# EAGLE design ledmatrixdriver (EAGLE 6.0)
8x8 RGB LED Matrix Driver (C) Elco Jacobs www.elcojacobs.com
DRAWING_AUTHOR: Elco Jacobs
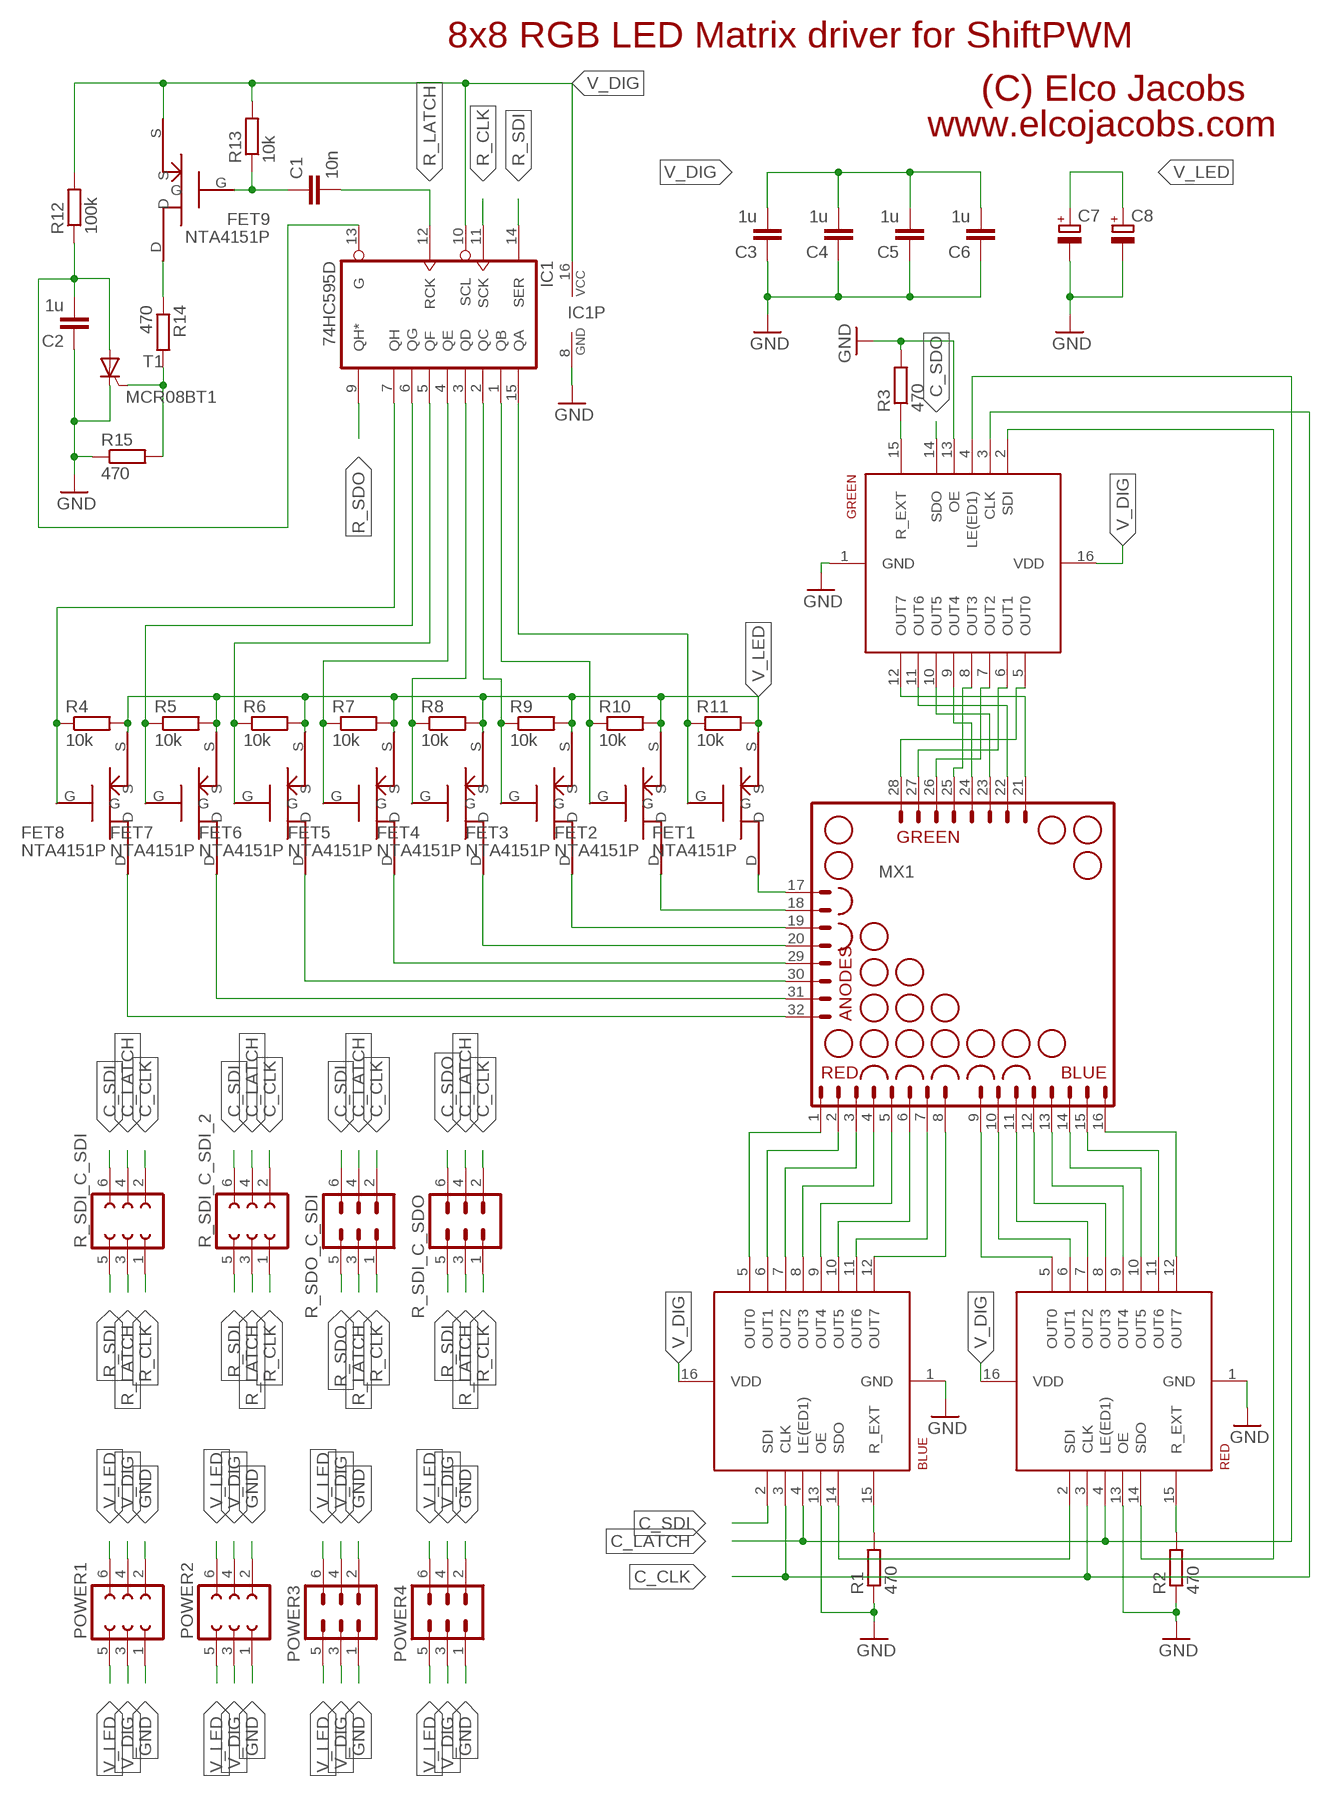
[diagram p0: schematic, sheet 1]

## Parts
BLUE  TLC5916  TLC5916/17  [SOIC-16]
C1  10n  C-EUC0805  [C0805]
C2  1u  C-EUC0805  [C0805]
C3  1u  C-EUC0805  [C0805]
C4  1u  C-EUC0805  [C0805]
C5  1u  C-EUC0805  [C0805]
C6  1u  C-EUC0805  [C0805]
C7  CPOL-EU153CLV-0505  [153CLV-0505]
C8  CPOL-EU153CLV-0505  [153CLV-0505]
FET1  NTA4151P  [NTA4151P]
FET2  NTA4151P  [NTA4151P]
FET3  NTA4151P  [NTA4151P]
FET4  NTA4151P  [NTA4151P]
FET5  NTA4151P  [NTA4151P]
FET6  NTA4151P  [NTA4151P]
FET7  NTA4151P  [NTA4151P]
FET8  NTA4151P  [NTA4151P]
FET9  NTA4151P  [NTA4151P]
GREEN  TLC5916  TLC5916/17  [SOIC-16]
IC1  74HC595D  [SO16]
MX1  MATRIX_8X8_TRICOLOR_ANODE_ROW  [MATRIX_60MM_32PIN]
POWER1  FE03-2W  [FE03-2W]
POWER2  FE03-2W  [FE03-2W]
POWER3  MA03-2W  [MA03-2W]
POWER4  MA03-2W  [MA03-2W]
R1  470  R-EU_R0805  [R0805]
R2  470  R-EU_R0805  [R0805]
R3  470  R-EU_R0805  [R0805]
R4  10k  R-EU_R0402  [R0402]
R5  10k  R-EU_R0402  [R0402]
R6  10k  R-EU_R0402  [R0402]
R7  10k  R-EU_R0402  [R0402]
R8  10k  R-EU_R0402  [R0402]
R9  10k  R-EU_R0402  [R0402]
R10  10k  R-EU_R0402  [R0402]
R11  10k  R-EU_R0402  [R0402]
R12  100k  R-EU_R0805  [R0805]
R13  10k  R-EU_R0402  [R0402]
R14  470  R-EU_R0805  [R0805]
R15  470  R-EU_R0805  [R0805]
R_SDI_C_SDI  FE03-2W  [FE03-2W]
R_SDI_C_SDI_2  FE03-2W  [FE03-2W]
R_SDI_C_SDO  MA03-2W  [MA03-2W]
R_SDO_C_SDI  MA03-2W  [MA03-2W]
RED  TLC5916  TLC5916/17  [SOIC-16]
T1  MCR08BT1  [SOT223]

## Nets
C_CLK: BLUE.3(CLK) GREEN.3(CLK) R_SDI_C_SDI.2 R_SDI_C_SDI_2.2 R_SDI_C_SDO.2 R_SDO_C_SDI.2 RED.3(CLK)
C_LATCH: BLUE.4(LE(ED1)) GREEN.4(LE(ED1)) R_SDI_C_SDI.4 R_SDI_C_SDI_2.4 R_SDI_C_SDO.4 R_SDO_C_SDI.4 RED.4(LE(ED1))
C_SDI: BLUE.2(SDI) R_SDI_C_SDI.6 R_SDI_C_SDI_2.6 R_SDO_C_SDI.6
C_SDO: GREEN.14(SDO) R_SDI_C_SDO.6
GND: BLUE.1(GND) BLUE.13(OE) C2.1 C3.1 C4.1 C5.1 C6.1 C7.- C8.- GREEN.1(GND) GREEN.13(OE) IC1.8(GND) POWER1.1 POWER1.2 POWER2.1 POWER2.2 POWER3.1 POWER3.2 POWER4.1 POWER4.2 R1.1 R2.1 R3.2 R15.1 RED.1(GND) RED.13(OE) T1.K(C)
N$1: BLUE.5(OUT0) MX1.1
N$2: BLUE.6(OUT1) MX1.2
N$3: BLUE.7(OUT2) MX1.3
N$4: BLUE.8(OUT3) MX1.4
N$5: BLUE.9(OUT4) MX1.5
N$6: BLUE.10(OUT5) MX1.6
N$7: BLUE.11(OUT6) MX1.7
N$8: BLUE.12(OUT7) MX1.8
N$10: MX1.10 RED.6(OUT1)
N$11: MX1.11 RED.7(OUT2)
N$12: MX1.12 RED.8(OUT3)
N$13: MX1.13 RED.9(OUT4)
N$14: MX1.14 RED.10(OUT5)
N$15: MX1.15 RED.11(OUT6)
N$16: MX1.16 RED.12(OUT7)
N$17: GREEN.12(OUT7) MX1.21
N$18: GREEN.11(OUT6) MX1.22
N$19: GREEN.10(OUT5) MX1.23
N$20: GREEN.9(OUT4) MX1.24
N$21: GREEN.8(OUT3) MX1.25
N$22: GREEN.7(OUT2) MX1.26
N$23: GREEN.6(OUT1) MX1.27
N$24: GREEN.5(OUT0) MX1.28
N$25: FET1.D MX1.17
N$26: FET2.D MX1.18
N$27: FET3.D MX1.19
N$28: FET4.D MX1.20
N$29: FET5.D MX1.29
N$30: FET6.D MX1.30
N$31: FET7.D MX1.31
N$32: FET8.D MX1.32
N$34: FET1.G IC1.15(QA) R11.1
N$35: FET2.G IC1.1(QB) R10.1
N$36: FET3.G IC1.2(QC) R9.1
N$37: FET4.G IC1.3(QD) R8.1
N$38: FET5.G IC1.4(QE) R7.1
N$39: FET6.G IC1.5(QF) R6.1
N$40: FET7.G IC1.6(QG) R5.1
N$41: C2.2 IC1.13(G) R12.1 T1.A T1.A2(A)
N$42: BLUE.15(R_EXT) R1.2
N$43: R2.2 RED.15(R_EXT)
N$44: GREEN.15(R_EXT) R3.1
N$45: BLUE.14(SDO) RED.2(SDI)
N$46: FET9.D R14.1
N$47: R14.2 R15.2 T1.G
N$48: GREEN.2(SDI) RED.14(SDO)
N$49: C1.1 FET9.G R13.1
OUT0B: MX1.9 RED.5(OUT0)
QH: FET8.G IC1.7(QH) R4.1
R_CLK: IC1.11(SCK) R_SDI_C_SDI.1 R_SDI_C_SDI_2.1 R_SDI_C_SDO.1 R_SDO_C_SDI.1
R_LATCH: C1.2 IC1.12(RCK) R_SDI_C_SDI.3 R_SDI_C_SDI_2.3 R_SDI_C_SDO.3 R_SDO_C_SDI.3
R_SDI: IC1.14(SER) R_SDI_C_SDI.5 R_SDI_C_SDI_2.5 R_SDI_C_SDO.5
R_SDO: IC1.9(QH*) R_SDO_C_SDI.5
V_DIG: BLUE.16(VDD) C3.2 C4.2 C5.2 C6.2 FET9.S GREEN.16(VDD) IC1.10(SCL) IC1.16(VCC) POWER1.3 POWER1.4 POWER2.3 POWER2.4 POWER3.3 POWER3.4 POWER4.3 POWER4.4 R12.2 R13.2 RED.16(VDD)
V_LED: C7.+ C8.+ FET1.S FET2.S FET3.S FET4.S FET5.S FET6.S FET7.S FET8.S POWER1.5 POWER1.6 POWER2.5 POWER2.6 POWER3.5 POWER3.6 POWER4.5 POWER4.6 R4.2 R5.2 R6.2 R7.2 R8.2 R9.2 R10.2 R11.2

## Notes on the sheet
- 8x8 RGB LED Matrix driver for ShiftPWM
- (C) Elco Jacobs
- www.elcojacobs.com

## Library data of the parts
BLUE GREEN RED = BillPorter:TLC5916/17: TLC5916/17 8-Channel Constant-Current LED Sink Driver and Shift Register in one. Great for driving high current LEDs that would kill a 595 shift register. Specs @ http://focus.ti.com/docs/prod/folders/print/tlc5916.html
C1-C6 = rcl:C-EU: CAPACITOR, European symbol
C7 C8 = rcl:CPOL-EU: POLARIZED CAPACITOR, European symbol
FET1-FET9 = NTA4151P:NTA4151P
IC1 = 74xx-eu:74*595: 8-bit SHIFT REGISTER, output latch
MX1 = matrix:MATRIX_8X8_TRICOLOR_ANODE_ROW: RGB 8x8 LED Matrix This variety of display has one anode pin for each row, and three cathode pins for each column. Each anode is shared by red, green and blue cathodes for each cell in the matrix. This part matches the matrix sold by LEDsee.com (SKU: RGBMATRIX) and Seeedstudio.com (SKU: LEDRGBMatrix). The datasheet lists the source as "Guoyexing Optoelectronics Co. Ltd.," part number GYXM-2388AURPGB.
POWER1 POWER2 R_SDI_C_SDI R_SDI_C_SDI_2 = con-lsta:FE03-2W: FEMALE HEADER
POWER3 POWER4 R_SDI_C_SDO R_SDO_C_SDI = con-lstb:MA03-2: PIN HEADER
R1-R15 = resistor:R-EU_: RESISTOR, European symbol
T1 = MCR08BT1:MCR08BT1

## Board
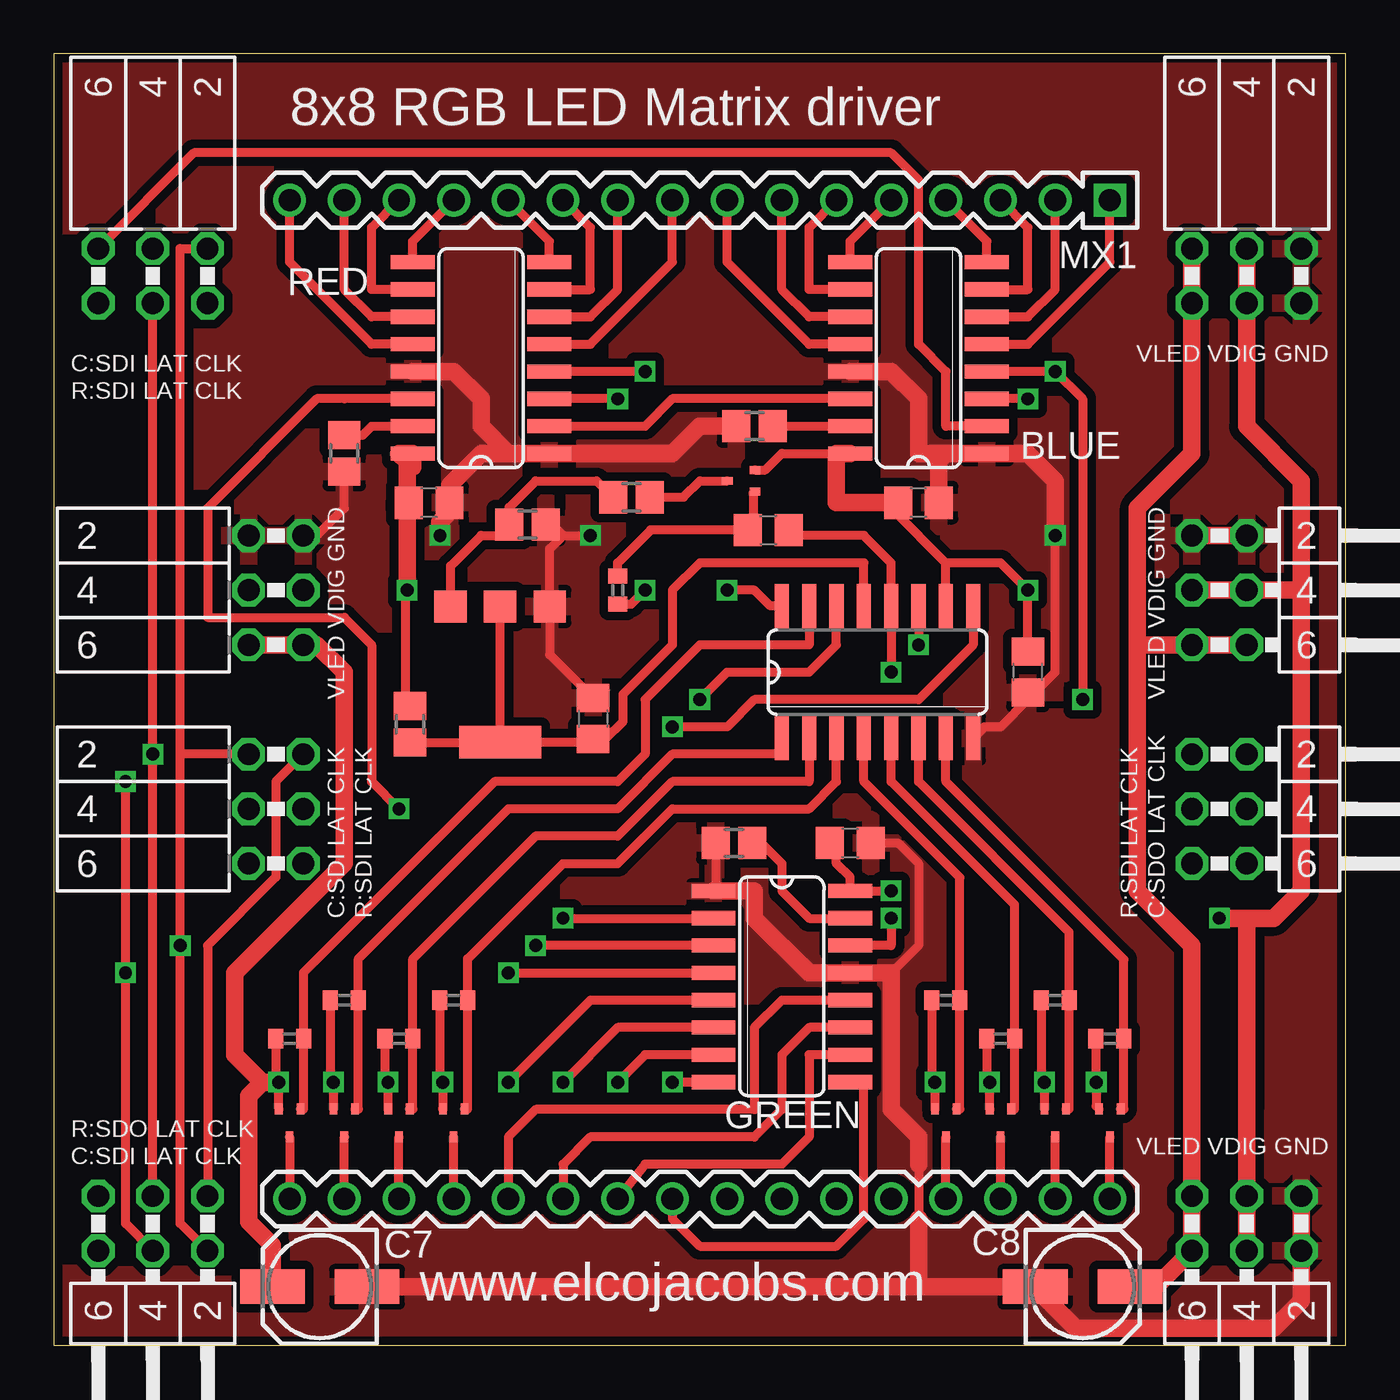
[diagram p1: board, top side]
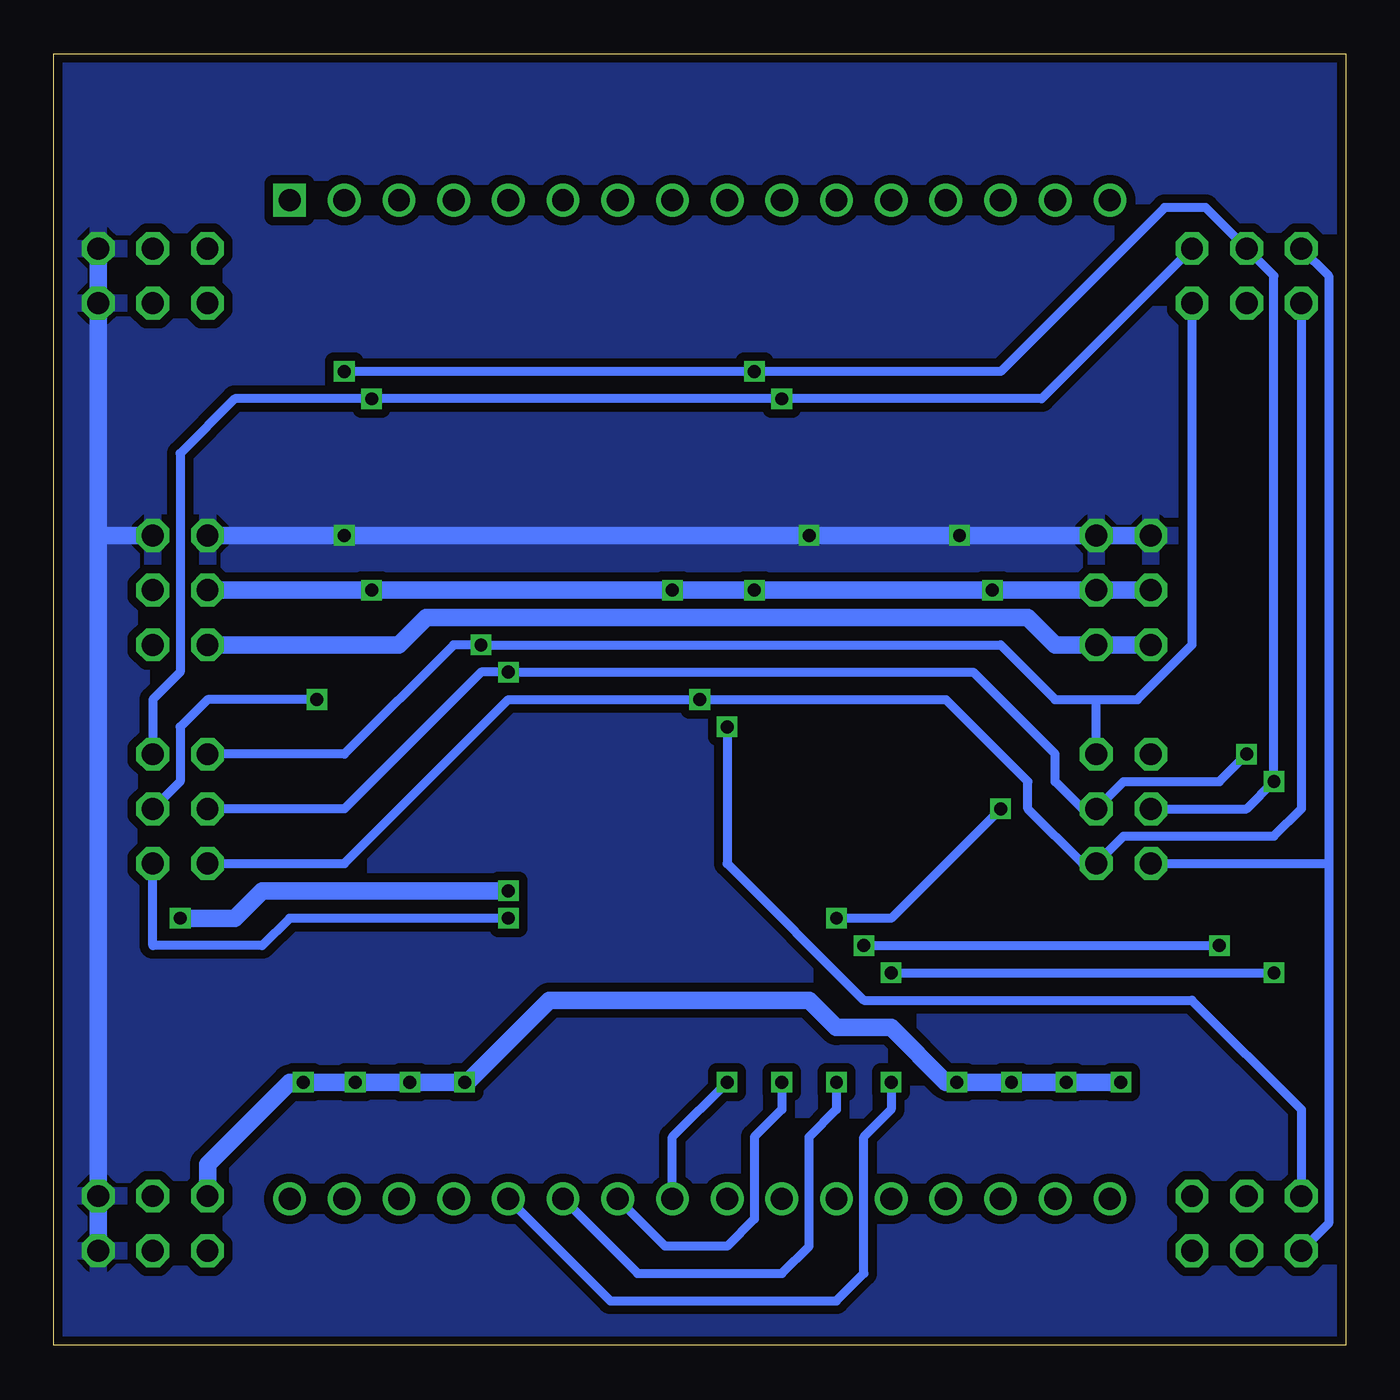
[diagram p2: board, bottom side, seen from below]

Size 60 x 60 mm. Coordinates in mm from the lower left corner, seen from the top.
Outline: 0,0 60,0 60,60 0,60 0,0
Copper layers (1*16): Top 0.0356mm / dielectric 1.5011mm / Bottom 0.0356mm
Design rules: minimum track width 6mil, minimum drill 13mil, track to track 6mil, track to pad 6mil, pad to pad 6mil, via to via 6mil, smd to smd 6mil, copper to edge 15mil, drill to drill 6mil, minimum pad ring 7mil, minimum via ring 7mil, stop-mask expansion 4mil, vias tented up to drill 0mil, thermal gap 10mil

### Footprints (pad centres in the part's own frame; a part is rotated, then mirrored left to right if it is on the bottom)
SOIC-16 = smd 0.66 x 2.032: 1 -3.81,-3.175; 2 -2.54,-3.175; 3 -1.27,-3.175; 4 0,-3.175; 5 1.27,-3.175; 6 2.54,-3.175; 7 3.81,-3.175; 8 5.08,-3.175; 9 5.08,3.175; 10 3.81,3.175; 11 2.54,3.175; 12 1.27,3.175; 13 0,3.175; 14 -1.27,3.175; 15 -2.54,3.175; 16 -3.81,3.175
C0805 = smd 1.3 x 1.5: 1 -0.95,0; 2 0.95,0
153CLV-0505 = smd 3 x 1.6: + 2.2,0; - -2.2,0
NTA4151P = smd 0.356 x 0.508: D 0,0; G -0.5,-1.295; S 0.5,-1.295
SO16 = smd 0.66 x 2.032: 1 -4.445,-3.073; 2 -3.175,-3.073; 3 -1.905,-3.073; 4 -0.635,-3.073; 5 0.635,-3.073; 6 1.905,-3.073; 7 3.175,-3.073; 8 4.445,-3.073; 9 4.445,3.073; 10 3.175,3.073; 11 1.905,3.073; 12 0.635,3.073; 13 -0.635,3.073; 14 -1.905,3.073; 15 -3.175,3.073; 16 -4.445,3.073
MATRIX_60MM_32PIN = drill 1.016 square: 1 -19.05,-23.2 | drill 1.016: 2 -16.51,-23.2; 3 -13.97,-23.2; 4 -11.43,-23.2; 5 -8.89,-23.2; 6 -6.35,-23.2; 7 -3.81,-23.2; 8 -1.27,-23.2; 9 1.27,-23.2; 10 3.81,-23.2; 11 6.35,-23.2; 12 8.89,-23.2; 13 11.43,-23.2; 14 13.97,-23.2; 15 16.51,-23.2; 16 19.05,-23.2; 17 19.05,23.2; 18 16.51,23.2; 19 13.97,23.2; 20 11.43,23.2; 21 8.89,23.2; 22 6.35,23.2; 23 3.81,23.2; 24 1.27,23.2; 25 -1.27,23.2; 26 -3.81,23.2; 27 -6.35,23.2; 28 -8.89,23.2; 29 -11.43,23.2; 30 -13.97,23.2; 31 -16.51,23.2; 32 -19.05,23.2
FE03-2W = drill 1.016 octagon: 1 -5.08,5.08; 2 -5.08,2.54; 3 -2.54,5.08; 4 -2.54,2.54; 5 0,5.08; 6 0,2.54
MA03-2W = drill 1.016 octagon: 1 -5.08,-5.08; 2 -5.08,-2.54; 3 -2.54,-5.08; 4 -2.54,-2.54; 5 0,-5.08; 6 0,-2.54
R0805 = smd 1.3 x 1.5: 1 -0.85,0; 2 0.85,0
R0402 = smd 0.7 x 0.9: 1 -0.65,0; 2 0.65,0
SOT223 = smd 3.8 x 1.5: A 0,6.3 | smd 1.5 x 1.5: A2 0,0; G 2.3,0; K -2.3,0

### Placement (x,y rotation side)
BLUE  40.16,45.24 90 top
C1  33.18,37.87 0 top
C2  25.05,29.11 270 top
C3  17.43,39.14 180 top
C4  40.16,39.14 180 top
C5  45.24,31.27 90 top
C6  36.99,23.33 180 top
C7  12.35,2.72 180 top
C8  47.78,2.72 0 top
FET1  10.95,9.68 180 top
FET2  13.49,9.68 180 top
FET3  16.03,9.68 180 top
FET4  18.57,9.68 180 top
FET5  41.43,9.68 180 top
FET6  43.97,9.68 180 top
FET7  46.51,9.68 180 top
FET8  49.05,9.68 180 top
FET9  31.27,40.16 90 top
GREEN  33.81,17.3 270 top
IC1  38.26,31.27 0 top
MX1  30,30 180 top
POWER1  52.86,53.5 180 top
POWER2  6.51,32.54 270 top
POWER3  52.86,1.85 180 top
POWER4  57.94,32.54 270 top
R1  32.54,42.7 0 top
R2  13.49,41.43 90 top
R3  31.59,23.33 180 top
R4  49.05,14.25 180 top
R5  46.51,16.03 180 top
R6  43.97,14.25 180 top
R7  41.43,16.03 180 top
R8  18.57,16.03 180 top
R9  16.03,14.25 180 top
R10  13.49,16.03 180 top
R11  10.95,14.25 180 top
R12  16.54,28.86 90 top
R13  26.19,35.08 270 top
R14  26.82,39.4 180 top
R15  22,38.13 180 top
R_SDI_C_SDI  2.06,53.5 180 top
R_SDI_C_SDI_2  6.51,22.38 270 top
R_SDI_C_SDO  57.94,22.38 270 top
R_SDO_C_SDI  2.06,1.85 180 top
RED  19.84,45.24 90 top
T1  20.73,34.32 180 top

### Tracks (layer width: path | path; a pad name or v marks a point on that pad's centre or on a via)
C_CLK  (via drill 0.6)
  Top 0.406: v26.19,43.97 RED.3 | v45.24,43.97 BLUE.3 | 5.87,27.46 v5.87,18.57 5.87,5.66 R_SDO_C_SDI.2 | 5.87,27.46 5.87,50.96 R_SDI_C_SDI.2 | R_SDI_C_SDI_2.2 5.87,27.46 | GREEN.3 v22.38,18.57
  Bottom 0.406: R_SDI_C_SDO.2 55.4,30 54.13,31.27 54.13,41.43 51.59,43.97 v45.24,43.97 v26.19,43.97 14.12,43.97 R_SDI_C_SDI.2 | v22.38,18.57 v5.87,18.57
C_LATCH  (via drill 0.6)
  Top 0.406: v27.46,45.24 RED.4 | v21.11,17.3 GREEN.4 | v47.78,30 47.78,43.97 v46.51,45.24 BLUE.4 | v3.33,26.19 v3.33,17.3 3.33,5.66 R_SDO_C_SDI.4
  Bottom 0.406: R_SDI_C_SDI_2.4 4.6,24.92 v3.33,26.19 3.33,49.69 R_SDI_C_SDI.4 6.51,52.86 8.41,52.86 16.03,45.24 v27.46,45.24 v46.51,45.24 | v47.78,30 52.86,30 54.13,28.73 54.13,26.19 R_SDI_C_SDO.4 | v21.11,17.3 v3.33,17.3
C_SDI
  Top 0.406: BLUE.2 41.43,42.7 41.43,45.24 40.16,46.51 40.16,54.13 38.89,55.4 6.51,55.4 R_SDI_C_SDI.6
  Bottom 0.406: 0.79,22.38 0.79,49.69 R_SDI_C_SDI.6 | 0.79,22.38 0.79,5.66 R_SDO_C_SDI.6 | R_SDI_C_SDI_2.6 0.79,22.38
C_SDO  (via drill 0.6)
  Top 0.406: v38.89,19.84 38.89,18.57 GREEN.14
  Bottom 0.406: v38.89,19.84 49.05,19.84 50.32,18.57 55.4,18.57 R_SDI_C_SDO.6
GND  (via drill 0.6)
  Top 0.406: 40.16,8.41 40.16,5.87 | v46.51,37.62 46.51,31.27 45.56,30.32 C5.1 45.24,30 43.97,28.73 43.23,28.73 IC1.8 | 20.92,41.24 21.11,41.43 28.73,41.43 | R15.1 23.14,38.13 23.65,37.62 | 23.65,37.62 v24.92,37.62 | 23.65,37.62 23.03,37 T1.K 23.03,32.08 C2.1 | C3.1 18.38,39.08 18.57,38.89 | POWER2.1 12.22,37.62 13.49,38.89 R2.1 | C6.1 39.21,23.33 40.16,22.38 40.16,18.57 38.89,17.3 | R3.2 30.74,21.21 GREEN.1 | 45.56,2.69 45.56,2.7 C8.-
  Top 0.813: 41.43,41.43 BLUE.1 45.24,41.43 46.51,40.16 v46.51,37.62 | 41.43,41.43 40.16,41.43 40.16,43.97 38.89,45.24 BLUE.13 | 21.11,41.43 RED.1 28.73,41.43 30,42.7 R1.1 | 21.11,41.43 19.84,42.7 19.84,43.97 18.57,45.24 RED.13 | POWER4.2 POWER4.1 | 40.16,8.41 40.16,9.68 38.89,10.95 38.89,17.3 GREEN.13 35.08,17.3 32.54,19.84 32.54,21.11 GREEN.1 | POWER3.1 POWER3.2 57.94,2.06 56.67,0.79 47.46,0.79 45.56,2.69 | C7.- 40.16,2.72 | 40.16,2.72 C8.- | 40.16,5.87 40.16,2.72 | C4.1 41.11,41.11 41.43,41.43 | C3.1 18.38,39.97 19.84,41.43 21.11,41.43 | v17.93,37.62 17.93,38.26 18.57,38.89
  Bottom 0.813: POWER4.1 v46.51,37.62 v24.92,37.62 v17.93,37.62 POWER2.1 POWER2.2 | 57.94,37.62 POWER1.1 POWER1.2 | 57.94,37.62 POWER3.2 | POWER4.2 57.94,37.62
  pour Bottom (isolate 0.406): -0.16,60.16 -0.16,0.16 60.16,0.16 60.16,60.16
  pour Top (isolate 0.406): -0.16,60.16 60.16,60.16 60.16,0.16 -0.16,0.16
N$1
  Top 0.406: BLUE.5 45.24,46.51 49.05,50.32 MX1.1
N$2
  Top 0.406: BLUE.6 45.24,47.78 46.51,49.05 MX1.2
N$3
  Top 0.406: BLUE.7 45.24,49.05 45.24,51.93 MX1.3
N$4
  Top 0.406: BLUE.8 43.34,51.3 MX1.4
N$5
  Top 0.406: BLUE.9 36.99,51.3 MX1.5
N$6
  Top 0.406: BLUE.10 35.08,49.05 35.08,51.93 MX1.6
N$7
  Top 0.406: BLUE.11 35.08,47.78 33.81,49.05 MX1.7
N$8
  Top 0.406: BLUE.12 35.08,46.51 31.27,50.32 MX1.8
N$10
  Top 0.406: RED.6 24.92,47.78 26.19,49.05 MX1.10
N$11
  Top 0.406: RED.7 24.92,49.05 24.92,51.93 MX1.11
N$12
  Top 0.406: RED.8 23.02,51.3 MX1.12
N$13
  Top 0.406: RED.9 16.66,51.3 MX1.13
N$14
  Top 0.406: RED.10 14.76,49.05 14.76,51.93 MX1.14
N$15
  Top 0.406: RED.11 14.76,47.78 13.49,49.05 MX1.15
N$16
  Top 0.406: RED.12 14.76,46.51 10.95,50.32 MX1.16
N$17
  Top 0.406: GREEN.12 33.81,16.03 32.54,14.76 32.54,10.95 22.38,10.95 21.11,9.68 MX1.21
N$18
  Top 0.406: GREEN.11 35.08,14.76 33.81,13.49 33.81,10.95 32.54,9.68 24.92,9.68 23.65,8.41 MX1.22
N$19
  Top 0.406: GREEN.10 35.08,13.49 35.08,9.68 33.81,8.41 27.46,8.41 MX1.23
N$20
  Top 0.406: MX1.24 28.73,5.87 30,4.6 36.35,4.6 37.62,5.87 37.62,12.22 GREEN.9
N$21  (via drill 0.6)
  Top 0.406: GREEN.8 v28.73,12.22
  Bottom 0.406: MX1.25 31.27,9.68 v28.73,12.22
N$22  (via drill 0.6)
  Top 0.406: GREEN.7 27.46,13.49 v26.19,12.22
  Bottom 0.406: v26.19,12.22 26.19,10.95 27.46,9.68 27.46,5.87 28.73,4.6 31.61,4.6 MX1.26
N$23  (via drill 0.6)
  Top 0.406: GREEN.6 26.19,14.76 v23.65,12.22
  Bottom 0.406: v23.65,12.22 23.65,10.95 24.92,9.68 24.92,4.6 26.19,3.33 32.88,3.33 MX1.27
N$24  (via drill 0.6)
  Top 0.406: GREEN.5 24.92,16.03 v21.11,12.22
  Bottom 0.406: v21.11,12.22 21.11,10.95 22.38,9.68 22.38,3.33 23.65,2.06 34.15,2.06 MX1.28
N$25
  Top 0.406: FET1.D MX1.17
N$26
  Top 0.406: MX1.18 FET2.D
N$27
  Top 0.406: MX1.19 FET3.D
N$28
  Top 0.406: MX1.20 FET4.D
N$29
  Top 0.406: MX1.29 FET5.D
N$30
  Top 0.406: MX1.30 FET6.D
N$31
  Top 0.406: MX1.31 FET7.D
N$32
  Top 0.406: MX1.32 FET8.D
N$34
  Top 0.406: FET1.G 11.6,10.97 R11.1 11.6,17.32 20.47,26.19 26.19,26.19 27.46,27.46 27.46,30 30,32.54 35.08,32.54 IC1.15
N$35
  Top 0.406: FET2.G 14.14,10.97 R10.1 14.14,17.95 21.11,24.92 26.19,24.92 28.73,27.46 33.81,27.46 IC1.1
N$36
  Top 0.406: FET3.G 16.68,10.97 R9.1 16.68,17.95 22.38,23.65 26.19,23.65 28.73,26.19 35.08,26.19 IC1.2
N$37
  Top 0.406: FET4.G 19.22,10.97 R8.1 19.22,17.95 23.65,22.38 26.19,22.38 28.73,24.92 35.08,24.92 36.35,26.19 IC1.3
N$38
  Top 0.406: FET5.G 42.08,10.97 R7.1 42.08,21.73 37.62,26.19 IC1.4
N$39
  Top 0.406: FET6.G 44.62,10.97 R6.1 44.62,20.46 38.89,26.19 IC1.5
N$40
  Top 0.406: FET7.G 47.16,10.97 R5.1 47.16,19.19 40.16,26.19 IC1.6
N$41
  Top 0.406: T1.A T1.A2 | R12.1 20.72,28.01 T1.A | T1.A 24.9,28.02 C2.2 25.62,28.16 26.44,28.98 26.44,30.25 28.73,32.54 28.73,35.08 30,36.35 37.62,36.35 IC1.13
N$42
  Top 0.406: R1.2 BLUE.15 37.62,42.7
N$43
  Top 0.406: R2.2 14.34,42.28 14.76,42.7 RED.15
N$44
  Top 0.406: R3.1 32.86,23.33 33.81,22.38 33.81,21.11 35.08,19.84 GREEN.15
N$45
  Top 0.406: RED.2 27.46,42.7 28.73,43.97 BLUE.14
N$46
  Top 0.406: R14.1 29.24,39.4 30,40.16 FET9.D
N$47
  Top 0.406: T1.G 18.43,36.21 19.84,37.62 21.11,37.62 21.11,38.09 R15.2 21.15,38.93 22.38,40.16 25.21,40.16 R14.2
N$48  (via drill 0.6)
  Top 0.406: 13.49,43.97 RED.14 12.22,43.97 7.14,38.89 7.14,33.81 13.49,33.81 14.76,32.54 14.76,26.19 v16.03,24.92 | v23.65,19.84 GREEN.2
  Bottom 0.406: v16.03,24.92 21.11,19.84 v23.65,19.84
N$49
  Top 0.406: FET9.G 32.48,39.57 32.48,37.68 | 32.48,37.68 32.54,37.62 | R13.1 26.19,36.35 27.71,37.87 C1.1 32.29,37.87 32.48,37.68
OUT0B
  Top 0.406: RED.5 24.92,46.51 28.73,50.32 MX1.9
QH
  Top 0.406: FET8.G 49.7,10.97 R4.1 49.7,17.92 41.43,26.19 IC1.7
R_CLK  (via drill 0.6)
  Top 0.406: IC1.11 v40.16,32.54 | R_SDO_C_SDI.1 7.14,18.57 10.31,21.75 10.31,26.19 R_SDI_C_SDI_2.1
  Bottom 0.406: R_SDI_C_SDO.1 46.51,27.46 41.43,32.54 v40.16,32.54 16.03,32.54 13.49,30 11.58,30 | R_SDI_C_SDI.1 7.14,32.54 9.68,30 11.58,30 | R_SDI_C_SDI_2.1 11.58,30
R_LATCH  (via drill 0.6)
  Top 0.406: R_SDO_C_SDI.3 v4.6,27.46 R_SDI_C_SDI.3 | v38.89,31.27 IC1.12 38.89,36.35 37.62,37.62 34.38,37.62 C1.2
  Bottom 0.406: R_SDI_C_SDO.3 46.51,24.92 40.16,31.27 v38.89,31.27 17.3,31.27 13.49,27.46 13.49,26.19 12.22,24.92 R_SDI_C_SDI_2.3 10.31,26.19 5.87,26.19 v4.6,27.46
R_SDI  (via drill 0.6)
  Top 0.406: v30,30 31.27,31.27 35.08,31.27 36.35,32.54 IC1.14
  Bottom 0.406: R_SDI_C_SDI.5 2.06,24.92 3.33,23.65 10.31,23.65 R_SDI_C_SDI_2.5 12.22,22.38 14.76,24.92 14.76,26.19 18.57,30 v30,30 38.89,30 46.51,22.38 R_SDI_C_SDO.5
R_SDO  (via drill 0.6)
  Top 0.406: IC1.9 42.7,32.54 40.16,30 32.54,30 31.27,28.73 v28.73,28.73
  Bottom 0.406: v28.73,28.73 28.73,22.38 22.38,16.03 7.14,16.03 2.06,10.95 R_SDO_C_SDI.5 2.06,8.16
V_DIG  (via drill 0.6)
  Top 0.406: 55.4,10.95 POWER3.3 POWER3.4 | IC1.10 41.43,36.35 | C4.2 38.89,38.82 38.96,38.82 41.43,36.35 | 41.43,36.35 43.97,36.35 v45.24,35.08 C5.2 | v16.41,35.08 16.32,34.99 16.32,29.92 R12.2 | C3.2 16.03,39.14 16.03,38.89 16.41,38.89 16.41,35.33 16.28,35.33 16.28,35.08 | FET9.S 33.04,40.66 33.81,41.43 36.35,41.43 | v31.27,35.08 32.54,35.08 33.28,34.34 IC1.16 | R13.2 26.81,34.43 v27.46,35.08 | C6.2 36.35,23.02 36.35,22.38 36.99,21.75 GREEN.16 v38.89,21.11
  Top 0.813: POWER4.3 POWER4.4 57.94,35.08 | BLUE.16 36.35,41.43 36.35,39.14 C4.2 | 55.4,19.84 55.4,10.95 POWER3.4 | 57.94,35.08 57.94,40.16 55.4,42.7 POWER1.3 POWER1.4 | 57.94,35.08 57.94,21.11 56.67,19.84 55.4,19.84 | v54.13,19.84 55.4,19.84 | 16.66,40.8 RED.16 16.03,41.43 16.41,41.05 16.41,35.33 v16.41,35.08
  Bottom 0.813: POWER2.4 POWER2.3 v16.41,35.08 v27.46,35.08 v31.27,35.08 v45.24,35.08 POWER4.3 | v38.89,21.11 50.32,21.11 51.59,19.84 v54.13,19.84
V_LED  (via drill 0.6)
  Top 0.406: FET1.S v10.45,12.21 v10.44,12.22 10.3,12.36 R11.2 | FET8.S 48.42,11.11 v48.42,12.22 48.4,12.23 R4.2 | FET7.S v46,12.22 45.86,12.36 R5.2 | FET6.S 43.47,10.94 v43.46,12.22 43.32,12.36 R6.2 | FET5.S v40.93,12.21 v40.92,12.22 40.78,12.36 R7.2 | FET4.S v18.06,12.22 17.92,12.36 R8.2 | FET3.S v15.53,12.21 v15.52,12.22 15.38,12.36 R9.2 | FET2.S v12.99,12.21 v12.98,12.22 12.84,12.36 R10.2
  Top 0.813: 50.32,32.54 50.32,21.11 52.86,18.57 POWER3.5 POWER3.6 51.29,2.82 C8.+ | 50.32,32.54 50.32,38.89 52.86,41.43 POWER1.5 POWER1.6 | POWER4.6 POWER4.5 50.32,32.54 | v10.44,12.22 9.68,12.22 | 9.68,12.22 8.41,13.49 8.41,17.3 13.49,22.38 13.49,31.27 12.22,32.54 POWER2.5 POWER2.6 | C7.+ 10.15,4.64 9.04,5.74 9.04,11.58 9.68,12.22
  Bottom 0.406: 40.8,12.22 41.43,12.22
  Bottom 0.813: v40.92,12.22 41.43,12.22 v43.46,12.22 v46,12.22 v48.42,12.22 49.05,12.22 52.86,8.41 52.86,7.14 | v18.07,12.21 v18.06,12.22 | v18.06,12.22 v15.52,12.22 v12.98,12.22 v10.44,12.22 | POWER2.6 13.49,32.54 14.76,33.81 42.7,33.81 43.97,32.54 POWER4.5 | v18.06,12.22 18.57,12.22 21.11,14.76 23.65,14.76 24.92,16.03 36.99,16.03 40.8,12.22

### Text on the board
tNames: 8x8 RGB LED Matrix driver | VLED VDIG GND | C:SDI LAT CLK | R:SDI LAT CLK | VLED VDIG GND | VLED VDIG GND | C:SDI LAT CLK | R:SDI LAT CLK | R:SDI LAT CLK | C:SDO LAT CLK | R:SDO LAT CLK | VLED VDIG GND | C:SDI LAT CLK | www.elcojacobs.com